# EAGLE design atrmega32u4_dev (EAGLE 8.3.0)
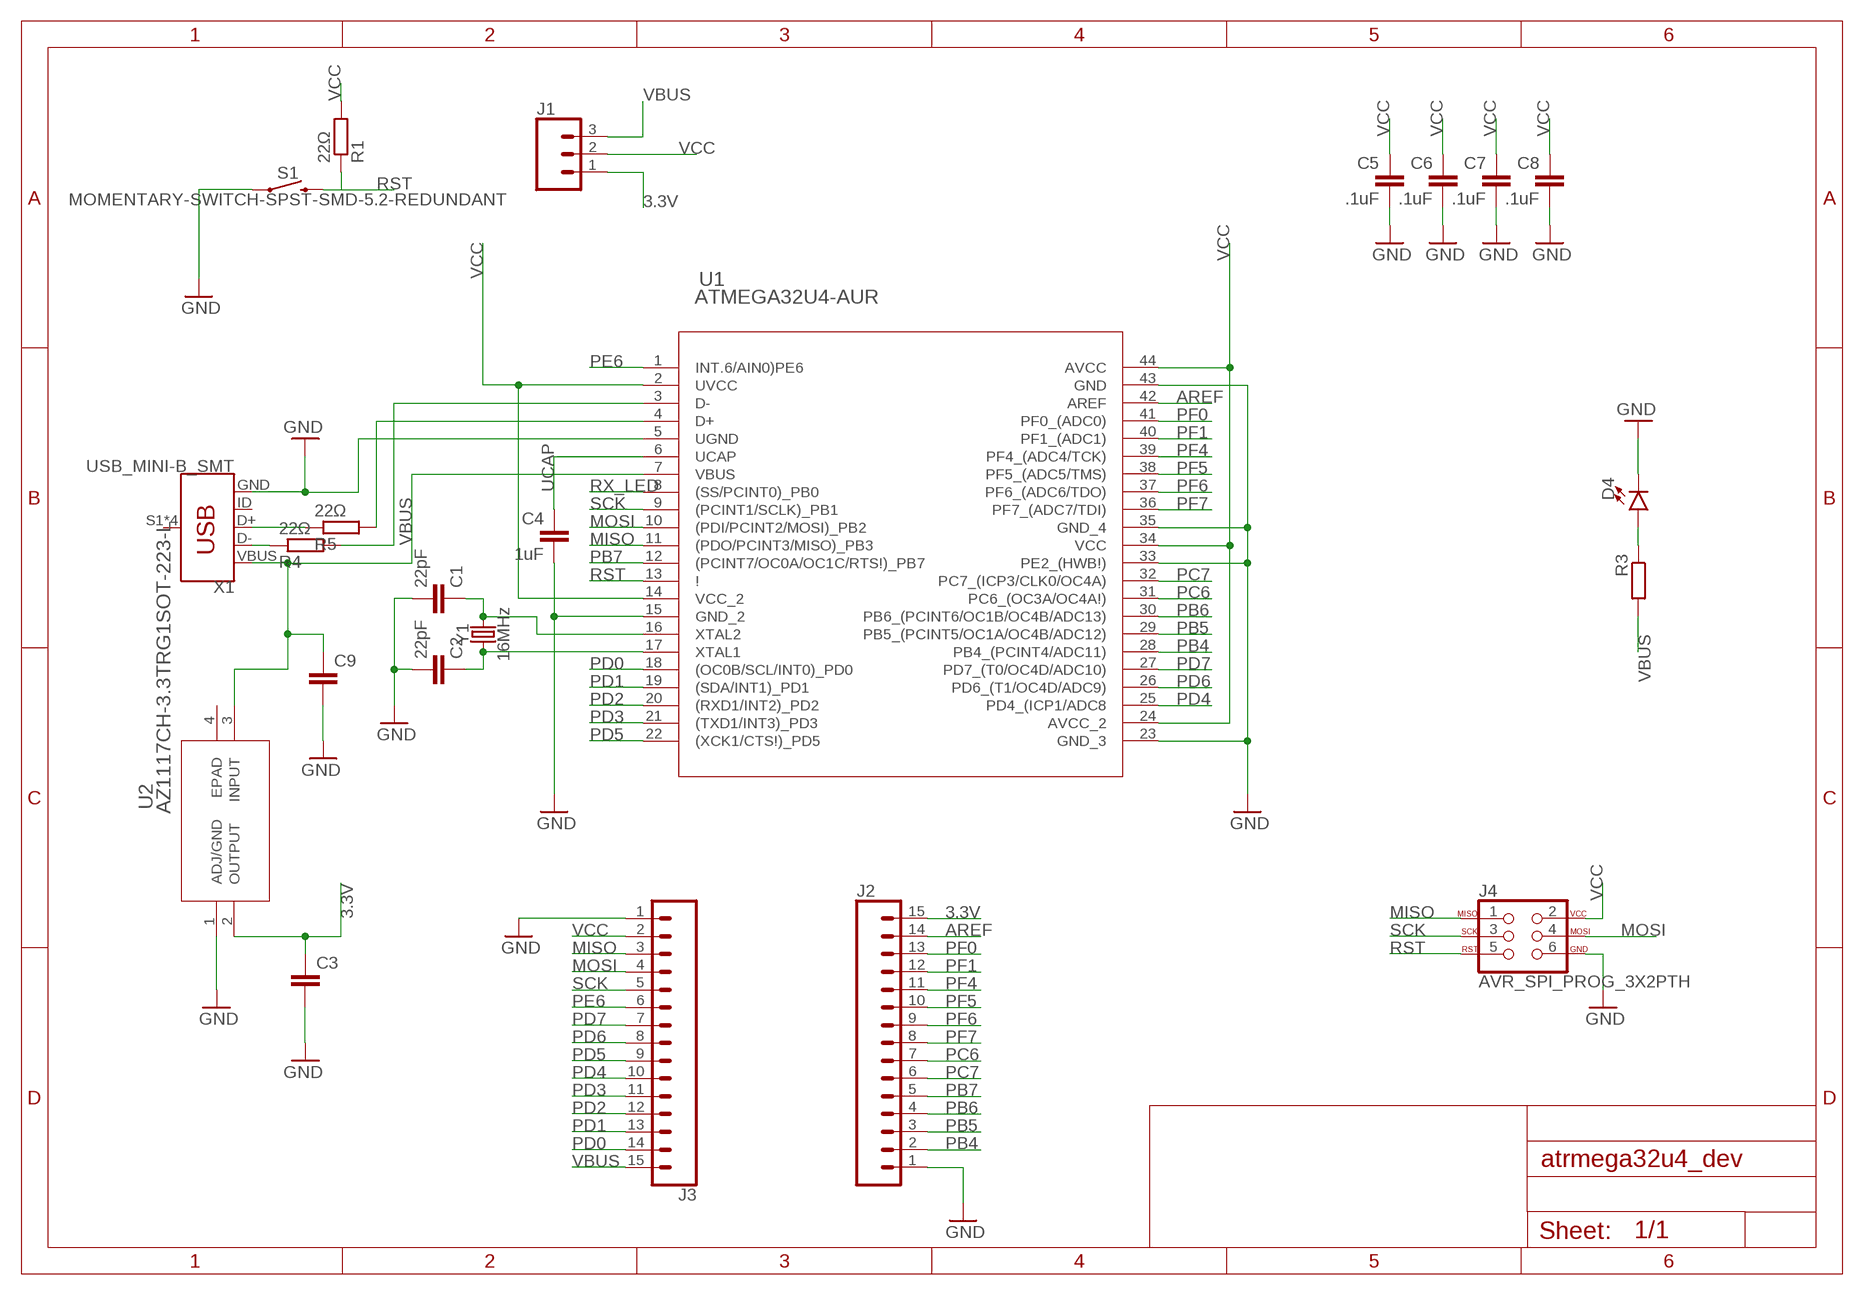
[diagram p0: schematic, sheet 1]

## Parts
C1  22pF  C-EUC0603  [C0603]
C2  22pF  C-EUC0603  [C0603]
C3  C-EUC0603  [C0603]
C4  1uF  C-EUC0603  [C0603]
C5  .1uF  C-EUC0603  [C0603]
C6  .1uF  C-EUC0603  [C0603]
C7  .1uF  C-EUC0603  [C0603]
C8  .1uF  C-EUC0603  [C0603]
C9  C-EUC0603  [C0603]
D4  LED0603  [LED-0603]
J1  CONN_03  [1X03]
J2  CONN_15  [1X15]
J3  CONN_15  [1X15]
J4  AVR_SPI_PROG_3X2PTH  [2X3]
R1  22Ω  R-EU_R0603  [R0603]
R3  R-EU_R0603  [R0603]
R4  22Ω  R-EU_R0603  [R0603]
R5  22Ω  R-EU_R0603  [R0603]
S1  MOMENTARY-SWITCH-SPST-SMD-5.2-REDUNDANT  [TACTILE_SWITCH_SMD_5.2MM]
U1  ATMEGA32U4-AUR  [44ML]
U2  AZ1117CH-3.3TRG1SOT-223-L  [SOT-223-L]
X1  USB_MINI-B_SMT  [USB-MINIB]
Y1  16MHz  CRYSTAL-16MHZSMD-5X3.2  [CRYSTAL-SMD-5X3.2-4PAD]

## Nets
3.3V: C3.1 J1.1 J2.15 U2.2(OUTPUT)
AREF: J2.14 U1.42(AREF)
D+: R5.2 U1.4(D+)
D-: R4.2 U1.3(D-)
GND: C1.2 C2.2 C3.2 C4.2 C5.2 C6.2 C7.2 C8.2 C9.2 D4.C J2.1 J3.1 J4.6 S1.1 S1.2 U1.5(UGND) U1.15(GND_2) U1.23(GND_3) U1.33(PE2_(HWB!)) U1.35(GND_4) U1.43(GND) U2.1(ADJ/GND) X1.GND
MISO: J3.3 J4.1 U1.11((PDO/PCINT3/MISO)_PB3)
MOSI: J3.4 J4.4 U1.10((PDI/PCINT2/MOSI)_PB2)
N$3: R5.1 X1.D+
N$4: D4.A R3.1
N$5: C1.1 U1.16(XTAL2) Y1.1
N$6: C2.1 U1.17(XTAL1) Y1.3
N$7: R4.1 X1.D-
PB4: J2.2 U1.28(PB4_(PCINT4/ADC11))
PB5: J2.3 U1.29(PB5_(PCINT5/OC1A/OC4B/ADC12))
PB6: J2.4 U1.30(PB6_(PCINT6/OC1B/OC4B/ADC13))
PB7: J2.5 U1.12((PCINT7/OC0A/OC1C/RTS!)_PB7)
PC6: J2.7 U1.31(PC6_(OC3A/OC4A!))
PC7: J2.6 U1.32(PC7_(ICP3/CLK0/OC4A))
PD0: J3.14 U1.18((OC0B/SCL/INT0)_PD0)
PD1: J3.13 U1.19((SDA/INT1)_PD1)
PD2: J3.12 U1.20((RXD1/INT2)_PD2)
PD3: J3.11 U1.21((TXD1/INT3)_PD3)
PD4: J3.10 U1.25(PD4_(ICP1/ADC8)
PD5: J3.9 U1.22((XCK1/CTS!)_PD5)
PD6: J3.8 U1.26(PD6_(T1/OC4D/ADC9))
PD7: J3.7 U1.27(PD7_(T0/OC4D/ADC10))
PE6: J3.6 U1.1(INT.6/AIN0)PE6)
PF0: J2.13 U1.41(PF0_(ADC0))
PF1: J2.12 U1.40(PF1_(ADC1))
PF4: J2.11 U1.39(PF4_(ADC4/TCK))
PF5: J2.10 U1.38(PF5_(ADC5/TMS))
PF6: J2.9 U1.37(PF6_(ADC6/TDO))
PF7: J2.8 U1.36(PF7_(ADC7/TDI))
RST: J4.5 R1.1 S1.3 S1.4 U1.13(!)
RX_LED: U1.8((SS/PCINT0)_PB0)
SCK: J3.5 J4.3 U1.9((PCINT1/SCLK)_PB1)
UCAP: C4.1 U1.6(UCAP)
VBUS: C9.1 J1.3 J3.15 R3.2 U1.7(VBUS) U2.3(INPUT) X1.VBUS
VCC: C5.1 C6.1 C7.1 C8.1 J1.2 J3.2 J4.2 R1.2 U1.2(UVCC) U1.14(VCC_2) U1.24(AVCC_2) U1.34(VCC) U1.44(AVCC)
Unconnected: U2.4(EPAD) X1.ID X1.S1(SHIELD) X1.S2(SHIELD) X1.S3(SHIELD) X1.S4(SHIELD)

## Library data of the parts
C1-C9 = rcl:C-EU: CAPACITOR, European symbol
D4 = SparkFun-LED:LED: LED (Generic) Standard schematic elements and footprints for 5mm, 3mm, 1206, and 0603 sized LEDs. Generic LEDs with no color specified.
J1 = SparkFun-Connectors:CONN_03: Multi connection point. Often used as Generic Header-pin footprint for 0.1 inch spaced/style header connections On any of the 0.1 inch spaced packages, you can populate with these: Break Away Headers - Straight <https://www.sparkfun.com/products/116> (PRT-00116) Break Away Male Headers - Right Angle <https://www.sparkfun.com/products/553> (PRT-00553) Female Headers <https://www.sparkfun.com/products/115> (PRT-00115) Break Away Headers - Machine Pin <https://www.sparkfun.com/products/117> (PRT-00117) Break Away Female Headers - Swiss Machine Pin <https://www.sparkfun.com/products/743> (PRT-00743) Stackable Header - 3 Pin (Female, 0.1") <https://www.sparkfun.com/products/13875> (PRT-13875) For SCREWTERMINALS and SPRING TERMINALS visit here: Screw Terimnals on SparkFun.com <https://www.sparkfun.com/search/results?term=Screw+Terminals> (5mm/3.5mm/2.54mm spacing) This device is also useful as a general connection point to wire up your design to another part of your project. Our various solder wires solder well into these plated through hole pads. Hook-Up Wire - Assortment (Stranded, 22 AWG) <https://www.sparkfun.com/products/11375> (PRT-11375) Hook-Up Wire - Assortment (Solid Core, 22 AWG) <https://www.sparkfun.com/products/11367> (PRT-11367) View the entire wire category on our website here <https://www.sparkfun.com/categories/141> Special notes: Molex polarized connector foot print use with SKU : PRT-08232 with associated crimp pins and housings.
J2 J3 = SparkFun-Connectors:CONN_15: Multi connection point. Often used as Generic Header-pin footprint for 0.1 inch spaced/style header connections On any of the 0.1 inch spaced packages, you can populate with these: Break Away Headers - Straight <https://www.sparkfun.com/products/116> (PRT-00116) Break Away Male Headers - Right Angle <https://www.sparkfun.com/products/553> (PRT-00553) Female Headers <https://www.sparkfun.com/products/115> (PRT-00115) Break Away Headers - Machine Pin <https://www.sparkfun.com/products/117> (PRT-00117) Break Away Female Headers - Swiss Machine Pin <https://www.sparkfun.com/products/743> (PRT-00743) For SCREWTERMINALS and SPRING TERMINALS visit here: Screw Terimnals on SparkFun.com <https://www.sparkfun.com/search/results?term=Screw+Terminals> (5mm/3.5mm/2.54mm spacing) This device is also useful as a general connection point to wire up your design to another part of your project. Our various solder wires solder well into these plated through hole pads. Hook-Up Wire - Assortment (Stranded, 22 AWG) <https://www.sparkfun.com/products/11375> (PRT-11375) Hook-Up Wire - Assortment (Solid Core, 22 AWG) <https://www.sparkfun.com/products/11367> (PRT-11367) View the entire wire category on our website here <https://www.sparkfun.com/categories/141> Special notes: Molex polarized connector foot print use with SKU : PRT-08231 with associated crimp pins and housings. 1MM SMD Version SKU: PRT-10208 NOTES ON THE VARIANTS LOCK and LOCK_LONGPADS... This footprint was designed to help hold the alignment of a through-hole component (i.e. 6-pin header) while soldering it into place. You may notice that each hole has been shifted either up or down by 0.005 of an inch from it's more standard position (which is a perfectly straight line). This slight alteration caused the pins (the squares in the middle) to touch the edges of the holes. Because they are alternating, it causes a "brace" to hold the component in place. 0.005 has proven to be the perfect amount of "off-center" position when using our standard breakaway headers. Although looks a little odd when you look at the bare footprint, once you have a header in there, the alteration is very hard to notice. Also,if you push a header all the way into place, it is covered up entirely on the bottom side.
J4 = SparkFun-Connectors:AVR_SPI_PROG_3X2: AVR ISP 6 Pin This is the reduced ISP connector for AVR programming. Common on Arduino. This footprint will take up less PCB space and can be used with a 10-pin to 6-pin adapter such as SKU: BOB-08508 **Special note about "TEST_POINT" package. The stop mask is on the top side, so if you want your programming test points to be on the bottom of your board, make sure to place this package on the bottom side of the board. This also ensure that the orientation to program from the bottom side will be correct. SparkFun Products: SparkFun ISP Pogo Adapter <https://www.sparkfun.com/products/11591> - NS Tiny AVR Programmer <https://www.sparkfun.com/products/11801> -PTH
R1 R3-R5 = resistor:R-EU_: RESISTOR, European symbol
S1 = SparkFun-Switches:MOMENTARY-SWITCH-SPST: Momentary Switch (Pushbutton) - SPST Normally-open (NO) SPST momentary switches (buttons, pushbuttons). Variants PTH-12MM - 12mm square, through-hole Momentary Pushbutton Switch - 12mm Square <https://www.sparkfun.com/products/9190> (COM-09190) PTH-6.0MM, PTH-6.0MM-KIT - 6.0mm square, through-hole Mini Pushbutton Switch <https://www.sparkfun.com/products/97> (COM-00097) KIT package intended for soldering kit's - only one side of pads' copper is exposed. PTH-RIGHT-ANGLE-KIT - Right-angle, through-hole Right Angle Tactile Button <https://www.sparkfun.com/products/10791> - Used on SparkFun BigTime Watch Kit <https://www.sparkfun.com/products/11734> SMD-12MM - 12mm square, surface-mount Tactile Button - SMD (12mm) <https://www.sparkfun.com/products/12993> (COM-12993) Used on SparkFun PicoBoard <https://www.sparkfun.com/products/11888> SMD-4.5MM - 4.5mm Square Trackball Switch Used on SparkFun Blackberry Trackballer Breakout <https://www.sparkfun.com/products/13169> SMD-4.6MMX2.8MM - 4.60mm x 2.80mm, surface mount Used on SparkFun SAMD21 Mini Breakout <https://www.sparkfun.com/products/13664> SMD-5.2MM, SMD-5.2-REDUNDANT - 5.2mm square, surface-mount Mini Pushbutton Switch - SMD <https://www.sparkfun.com/products/8720> (COM-08720) Used on Arduino Pro Mini <https://www.sparkfun.com/products/11114> REDUNDANT package connects both switch circuits together SMD-6.0X3.5MM - 6.0 x 3.5mm, surface mount Momentary Reset Switch SMD <https://www.sparkfun.com/products/8229> (COM-08229) SMD-6.2MM-TALL - 6.2mm square, surface mount Tactile Button - SMD (6mm) <https://www.sparkfun.com/products/12992> Used on SparkFun Digital Sandbox <https://www.sparkfun.com/products/12651> SMD-RIGHT-ANGLE - Right-angle, surface mount Used on SparkFun Block for Intel® Edison - Arduino <https://www.sparkfun.com/products/13036>; PROD_ID: SWCH-08247; SF_SKU: COM-08720
U1 = MyLibrary - Microcontroller:ATMEGA32U4-AUR; MANUFACTURER_PART_NUMBER: ATMEGA32U4AUR; VENDOR: Atmel
U2 = MyLibrary - Components:AZ1117CH-3.3TRG1; MANUFACTURER_PART_NUMBER: AZ1117CH3.3TRG1; VENDOR: Diodes Inc
X1 = SparkFun-Connectors:USB_MINI-B: USB type Mini-B Connector Breaks out 5th pin, and includes shield pins if needed. SparkFun Products: SparkFun FTDI Basic Breakout <https://www.sparkfun.com/products/9716> SparkFun XBee Explorer USB <https://www.sparkfun.com/products/11812> SparkFun Redboard <https://www.sparkfun.com/products/12757>; PROD_ID: CONN-08193; SF_ID: PRT-00587
Y1 = SparkFun-Clocks:CRYSTAL-16MHZ: 16MHz Crystal Digikey Example <http://www.digikey.com/product-search/en?keywords=535-9122-1-ND> Frequency: 16MHz Frequency Stability: ±50ppm Frequency Tolerance: ±20ppm Load Capacitance: 18pF SparkFun Products: Pro Micro -5V/16MHz <https://www.sparkfun.com/products/12640> SparkFun Serial Enabled LCD Kit <https://www.sparkfun.com/products/10097>; PROD_ID: XTAL-08218; SF_ID: COM-00094

## Board
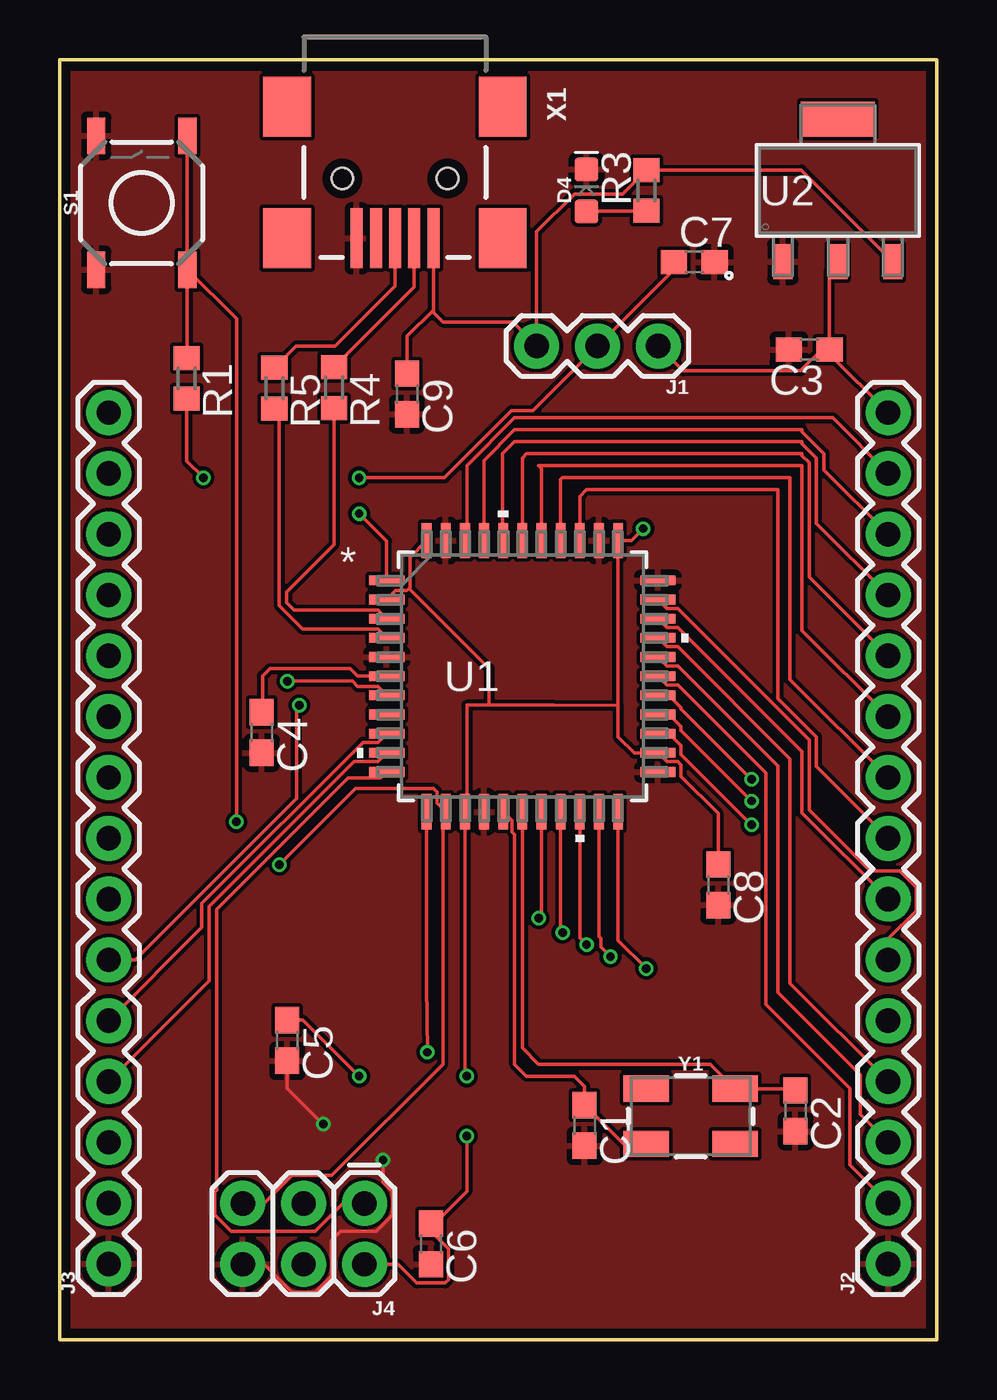
[diagram p1: board, top side]
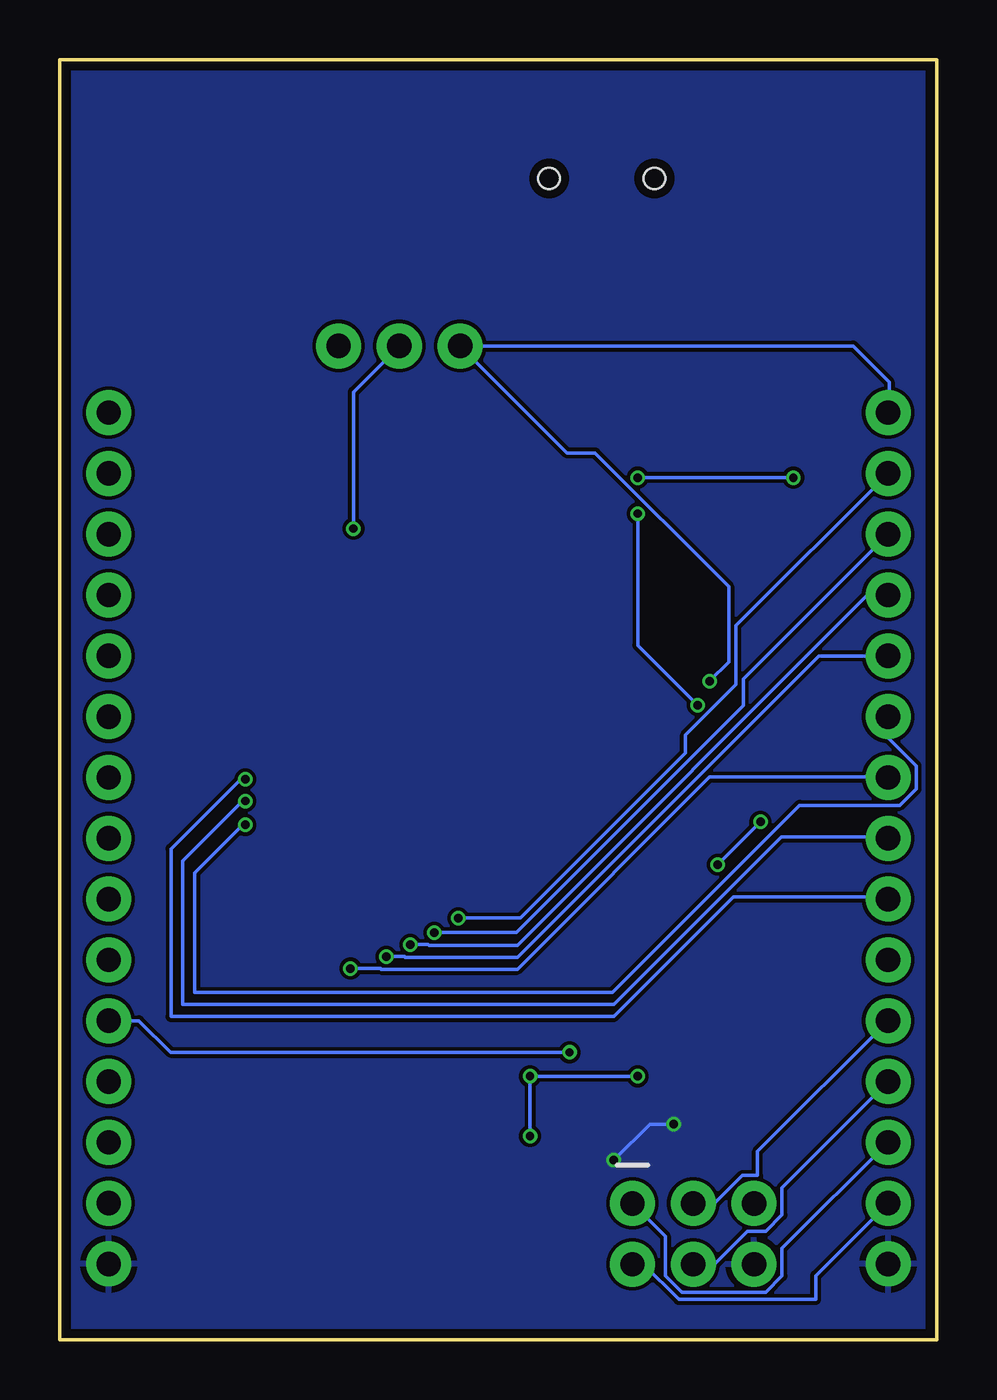
[diagram p2: board, bottom side, seen from below]

Size 36.64 x 53.45 mm. Coordinates in mm from the lower left corner, seen from the top.
Outline: 0,0 0,53.45 36.64,53.45 36.64,0 0,0
Copper layers (1*16): Top 0.035559375mm / dielectric 1.6mm / Bottom 0.035559375mm
Design rules "oshpark-2layer": minimum track width 6mil, minimum drill 10mil, track to track 6mil, track to pad 6mil, pad to pad 6mil, via to via 6mil, smd to smd 6mil, copper to edge 15mil, drill to drill 6mil, minimum pad ring 5mil, minimum via ring 5mil, stop-mask expansion 2.5mil, vias tented up to drill 0mil, thermal gap 10mil

### Footprints (pad centres in the part's own frame; a part is rotated, then mirrored left to right if it is on the bottom)
C0603 = smd 1.1 x 1: 1 -0.85,0; 2 0.85,0
LED-0603 = smd 1 x 1: A -0.877,0; C 0.877,0
1X03 = drill 1.016 pad 1.88: 1 0,0; 2 2.54,0; 3 5.08,0
1X15 = drill 1.016 pad 1.88: 1 0,0; 2 2.54,0; 3 5.08,0; 4 7.62,0; 5 10.16,0; 6 12.7,0; 7 15.24,0; 8 17.78,0; 9 20.32,0; 10 22.86,0; 11 25.4,0; 12 27.94,0; 13 30.48,0; 14 33.02,0; 15 35.56,0
2X3 = drill 1.016 pad 1.88: 1 0,0; 2 0,2.54; 3 2.54,0; 4 2.54,2.54; 5 5.08,0; 6 5.08,2.54
R0603 = smd 1 x 1.1: 1 -0.85,0; 2 0.85,0
TACTILE_SWITCH_SMD_5.2MM = smd 1.524 x 0.762: 1 -2.794,1.905; 2 2.794,1.905; 3 -2.794,-1.905; 4 2.794,-1.905
44ML = smd 1.473 x 0.406: 1 -5.664,4; 2 -5.664,3.2; 3 -5.664,2.4; 4 -5.664,1.6; 5 -5.664,0.8; 6 -5.664,0; 7 -5.664,-0.8; 8 -5.664,-1.6; 9 -5.664,-2.4; 10 -5.664,-3.2; 11 -5.664,-4; 23 5.664,-4; 24 5.664,-3.2; 25 5.664,-2.4; 26 5.664,-1.6; 27 5.664,-0.8; 28 5.664,0; 29 5.664,0.8; 30 5.664,1.6; 31 5.664,2.4; 32 5.664,3.2; 33 5.664,4 | smd 0.406 x 1.473: 12 -4,-5.664; 13 -3.2,-5.664; 14 -2.4,-5.664; 15 -1.6,-5.664; 16 -0.8,-5.664; 17 0,-5.664; 18 0.8,-5.664; 19 1.6,-5.664; 20 2.4,-5.664; 21 3.2,-5.664; 22 4,-5.664; 34 4,5.664; 35 3.2,5.664; 36 2.4,5.664; 37 1.6,5.664; 38 0.8,5.664; 39 0,5.664; 40 -0.8,5.664; 41 -1.6,5.664; 42 -2.4,5.664; 43 -3.2,5.664; 44 -4,5.664
SOT-223-L = smd 0.8 x 1.456: 1 -2.3,-2.974; 2 0,-2.974; 3 2.3,-2.974 | smd 3.1 x 1.456: 4 0,2.974
USB-MINIB = smd 2.5 x 0.5: D+ 2.5,0; D- 2.5,0.8; GND 2.5,-1.6; ID 2.5,-0.8; VBUS 2.5,1.6 | smd 2.5 x 2: S1 -3,4.5; S2 2.5,4.5; S3 -3,-4.5; S4 2.5,-4.5 | hole 0.9: 0,2.2; 0,-2.2
CRYSTAL-SMD-5X3.2-4PAD = smd 1.9 x 1.1: 1 -1.85,-1.15; 2 1.85,-1.15; 3 1.85,1.15; 4 -1.85,1.15

### Placement (x,y rotation side)
C1  21.92,8.95 270 top
C2  30.73,9.56 270 top
C3  31.3,41.36 180 top
C4  8.43,25.36 270 top
C5  9.5,12.5 270 top
C6  15.5,4 270 top
C7  26.5,45 0 top
C8  27.5,19 270 top
C9  14.5,39.5 270 top
D4  22,48 90 top
J1  25,41.5 180 top
J2  34.6,3.16 90 top
J3  2.04,3.16 90 top
J4  12.72,5.69 180 top
R1  5.3,40.15 270 top
R3  24.5,48 90 top
R4  11.46,39.76 270 top
R5  8.97,39.74 270 top
S1  3.42,47.48 90 top
U1  19.32,27.71 0 top
U2  32.5,48 0 top
X1  14,48.5 270 top
Y1  26.35,9.33 0 top

### Tracks (layer width: path | path; a pad name or v marks a point on that pad's centre or on a via)
3.3V
  Top 0.152: 32.15,40.92 C3.1 | C3.1 32.15,44.68 U2.2 | C3.1 31.82,41.36 30.94,40.47 26.03,40.47 J1.1 | C3.1 32.15,41.17 J2.15
AREF
  Top 0.152: U1.42 17,33.45 17,36.5 19,38.5 32.28,38.5 J2.14
D+
  Top 0.152: U1.4 13.29,29.68 10.14,29.68 9.16,30.65 9.16,38.69 R5.2
D-
  Top 0.152: R4.2 11.46,33.2 9.47,31.22 9.47,30.78 9.78,30.47 13.3,30.47 U1.3
GND  (via drill 0.35)
  Top 0.152: 12.4,46.4 X1.GND | 31.05,8.71 C2.2 | C5.2 9.5,10.5 v11,9 | J4.6 8.53,3.15 9.7,1.98 10.66,1.98 11.35,2.67 11.35,4.14 11.73,4.52 13.2,4.52 13.89,5.21 13.89,6.17 13.5,6.56 v13.5,7.5
  Bottom 0.152: v11,9 12,9 v13.5,7.5
  pour Top: 0,53.5 36.65,53.45 36.65,0 0,0
  pour Bottom: 0,0 36.65,0 36.65,53.35 36.5,53.5 0,53.5
MISO
  Top 0.152: J4.1 11.83,5.69 10.66,4.52 7.16,4.52 6.47,5.21 6.47,6.17 6.54,6.24 6.54,17.96 12.04,23.46 13.4,23.46 U1.11
  Bottom 0.152: J4.1 11.35,4.32 11.35,2.67 10.66,1.98 7.16,1.98 6.47,2.67 6.47,3.81 J3.3
MOSI
  Top 0.152: J3.4 6.24,14.98 6.24,18.09 12.29,24.14 13.29,24.14 U1.10
  Bottom 0.152: J4.4 9.29,3.15 7.92,4.52 7.16,4.52 6.47,5.21 6.47,6.35 J3.4
N$3
  Top 0.152: X1.D+ 14,44 11.5,41.5 9.88,41.5 R5.1
N$4
  Top 0.152: D4.A 24.47,47.12 R3.1
N$5
  Top 0.152: U1.16 18.89,21.68 18.89,21.21 19,21.1 19,11.5 19.5,11 21.5,11 21.92,10.58 C1.1 23.54,8.18 Y1.1
N$6
  Top 0.152: U1.17 19.32,12.18 20,11.5 27.18,11.5 Y1.3 30.66,10.48 C2.1
N$7
  Top 0.152: X1.D- 14.8,43.95 R4.1
PB4
  Top 0.152: U1.28 25.35,27.34 25.82,27.34 29.5,23.66 29.5,14 33,10.5 33,7.3 J2.2
PB5
  Top 0.152: U1.29 25.35,28.14 25.82,28.14 30,23.96 30,14.5 33.43,11.07 33.43,9.41 J2.3
PB6
  Top 0.152: U1.30 25.35,28.94 25.82,28.94 30.5,24.26 30.5,14.88 J2.4
PB7  (via drill 0.35)
  Top 0.152: U1.12 15.32,14.82 v15.35,12
  Bottom 0.152: v15.35,12 32.02,12 33.34,13.32 J2.5
PC6
  Top 0.152: U1.31 25.35,29.74 25.82,29.74 31,24.56 31,22 J2.7
PC7
  Top 0.152: U1.32 25.35,30.54 25.82,30.54 31.3,25.05 31.3,22.13 33.86,19.57 35.08,19.57 35.77,18.88 35.77,17.92 34.6,16.75 J2.6
PD0  (via drill 0.35)
  Top 0.152: U1.18 20.12,17.73 v20,17.61
  Bottom 0.152: v20,17.61 17.39,17.61 10.5,24.5 10.5,25.25 8.39,27.36 8.39,29.83 J3.14
PD1  (via drill 0.35)
  Top 0.152: U1.19 20.92,17.08 v21,17
  Bottom 0.152: J3.13 8.09,27.59 8.09,26.48 17.57,17 v21,17
PD2  (via drill 0.35)
  Top 0.152: U1.20 21.72,16.78 v22,16.5
  Bottom 0.152: v22,16.5 21.25,16.5 21.22,16.47 17.53,16.47 2.9,31.1 J3.12
PD3  (via drill 0.35)
  Top 0.152: U1.21 22.52,16.84 22.61,16.75 22.61,16.39 v23,16
  Bottom 0.152: v23,16 22.25,16 22.22,15.97 17.53,15.97 4.94,28.56 J3.11
PD4  (via drill 0.35)
  Top 0.152: v28.89,21.5 25.95,24.44 25.95,24.81 25.45,25.31 U1.25
  Bottom 0.152: v28.89,21.5 29,21.5 31,19.5 31,14.5 13.56,14.5 5.75,22.31 1.56,22.31 0.87,23 0.87,23.96 2.04,25.13 J3.10
PD5  (via drill 0.35)
  Top 0.152: U1.22 23.32,16.68 v24.5,15.5
  Bottom 0.152: v24.5,15.5 23.25,15.5 23.22,15.47 17.53,15.47 9.5,23.5 2.06,23.5 J3.9
PD6  (via drill 0.35)
  Top 0.152: v28.89,22.5 25.95,25.44 25.95,25.61 25.45,26.11 U1.26
  Bottom 0.152: v28.89,22.5 29,22.5 31.5,20 31.5,14 13.5,14 6.5,21 2.1,21 J3.8
PD7  (via drill 0.35)
  Top 0.152: v28.89,23.41 25.95,26.35 25.95,26.41 25.45,26.91 U1.27
  Bottom 0.152: v28.89,23.41 29.09,23.41 32,20.5 32,13.5 13.5,13.5 8.5,18.5 2.14,18.5 J3.7
PE6  (via drill 0.35)
  Top 0.152: U1.1 13.66,33.34 v12.5,34.5 | J3.6 3.15,15.86 9.89,22.61 9.89,26.39 v10,26.5
  Bottom 0.152: v12.5,34.5 12.5,29 v10,26.5
PF0
  Top 0.152: U1.41 17.72,36.72 19,38 31,38 31,37.93 31.91,37.02 31.91,36.33 J2.13
PF1
  Top 0.152: U1.40 18.5,33.39 18.5,37 19,37.5 31,37.5 31,37.43 31.61,36.82 31.61,34.09 J2.12
PF4
  Top 0.152: U1.39 19.32,36.82 19.5,37 31,37 31,36.93 31.3,36.63 31.3,31.85 J2.11
PF5
  Top 0.152: U1.38 20.12,36.38 20,36.5 31,36.5 31,29.62 J2.10
PF6
  Top 0.152: U1.37 20.92,35.92 21,36 30.5,36 30.5,27.58 J2.9
PF7
  Top 0.152: U1.36 21.72,35.22 22,35.5 30,35.5 30,26.79 31.61,25.18 31.61,23.93 J2.8
RST  (via drill 0.35)
  Top 0.152: S1.4 S1.3 | J4.5 8.53,5.69 9.7,6.86 11.36,6.86 16,11.5 16,21.93 U1.13 15.75,22.41 15.75,22.88 15.62,23.01 12.34,23.01 v9.17,19.83 | v7.38,21.62 7.38,42.64 S1.3 | S1.3 5.33,41.02 R1.1
  Bottom 0.152: v9.17,19.83 v7.38,21.62
SCK
  Top 0.152: 13.03,25.31 U1.9 13.29,24.94 12.66,24.94 5.93,18.21 5.93,17.21 J3.5
  Bottom 0.152: J4.3 9.29,5.69 8.12,6.86 7.5,6.86 7.5,7.86 J3.5
UCAP
  Top 0.152: C4.1 8.47,26.25 8.47,27.72 8.78,28.03 12.12,28.03 12.44,27.71 U1.6
VBUS  (via drill 0.35)
  Top 0.152: U2.3 30.98,48.85 R3.2 23.5,47.85 21.49,47.85 19.92,46.28 J1.3 18.92,42.5 16,42.5 15.6,42.9 15.6,43.01 | 15.6,43.01 X1.VBUS | v9.5,27.5 12.22,27.5 12.44,27.28 13.29,27.28 U1.7 | C9.1 14.5,41.91 15.6,43.01
  Bottom 0.152: v9.5,27.5 8.7,28.3 8.7,31.45 14.28,37.03 15.45,37.03 J1.3 3.5,41.5 2,40 2,38.76 J3.15
VCC  (via drill 0.35)
  Top 0.152: 24.99,24.5 U1.24 | 24.99,24.5 25.35,24.14 25.82,24.14 25.95,24.01 25.95,23.52 27.5,21.97 C8.1 | J4.2 14.13,3.15 14.91,2.37 16.09,2.37 16.23,2.51 16.23,3.79 15.5,4.52 15.5,4.69 | 15.5,4.69 C6.1 | C7.1 25.65,44.69 J1.2 19.77,38.8 18.87,38.8 16.07,36 v12.5,36 | v17,11 16.92,11.08 U1.14 17,22.13 17,26.5 18,26.5 | v17,8.5 17,6.19 15.5,4.69 | 14.59,31.38 14.62,31.41 14.62,32.67 U1.44 | 14.59,31.38 14.49,31.28 14.02,31.28 U1.2 | 23.32,26.49 U1.34 23.87,33.37 v24.38,33.88 | 23.32,26.49 23.32,25.18 24,24.5 24.99,24.5 | 18,26.5 20.63,26.5 23.32,26.49 | R1.2 5.3,36.7 v6,36 | 14.59,31.38 17.94,28.03 17.94,26.57 18,26.5 | C5.1 10.15,13.35 v12.5,11
  Bottom 0.152: J4.2 12.26,3.15 10.79,1.68 5.06,1.68 5.06,2.68 J3.2 | v17,8.5 v17,11 v12.5,11 | v24.38,33.88 24.38,39.59 J1.2 | v6,36 v12.5,36